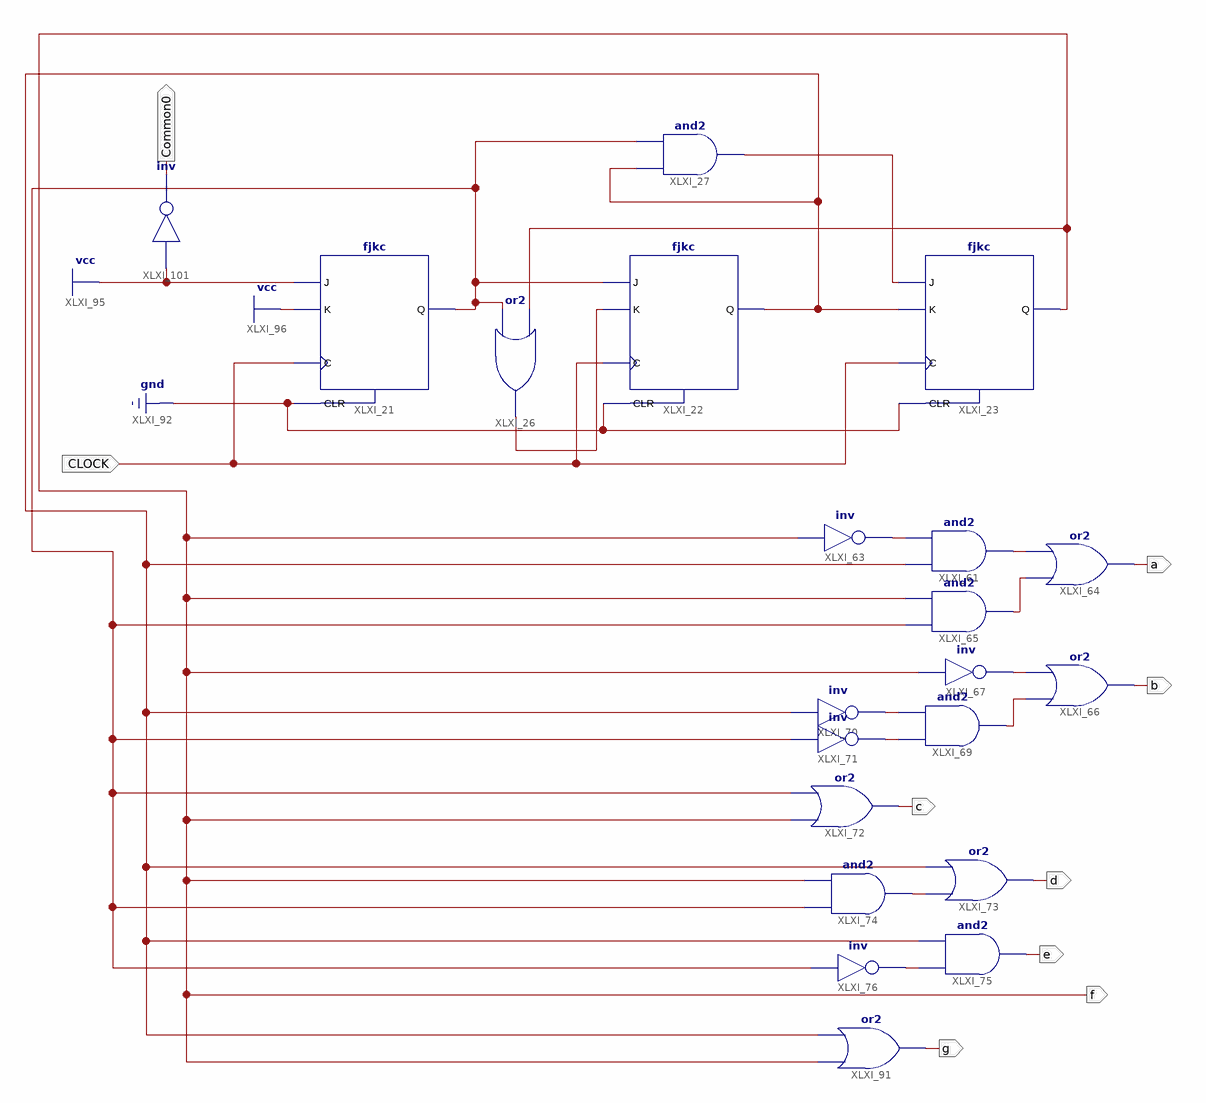
[diagram p0: schematic sheet 1]
// Xilinx ISE schematic CarBuzzer.sch (spartan6) as structural Verilog: 21 symbols, 9 ports
module CarBuzzer (
  input  CLOCK,
  output f,
  output b,
  output c,
  output d,
  output e,
  output g,
  output a,
  output Common0
);

  wire apin, XLXN_3, XLXN_10, XLXN_12, XLXN_81, XLXN_82, XLXN_86, XLXN_87, XLXN_89, XLXN_90, XLXN_91,
       XLXN_92, XLXN_93;

  fjkc XLXI_21 (.C(CLOCK), .CLR(1'b0), .J(1'b1), .K(1'b1), .Q(apin));
  fjkc XLXI_23 (.C(CLOCK), .CLR(1'b0), .J(XLXN_3), .K(XLXN_10), .Q(f));
  fjkc XLXI_22 (.C(CLOCK), .CLR(1'b0), .J(apin), .K(XLXN_12), .Q(XLXN_10));
  and XLXI_27 (XLXN_3, XLXN_10, apin);
  or XLXI_26 (XLXN_12, apin, f);
  and XLXI_61 (XLXN_82, XLXN_10, XLXN_81);
  not XLXI_63 (XLXN_81, f);
  or XLXI_64 (a, XLXN_86, XLXN_82);
  and XLXI_65 (XLXN_86, apin, f);
  or XLXI_66 (b, XLXN_89, XLXN_87);
  not XLXI_67 (XLXN_87, f);
  and XLXI_69 (XLXN_89, XLXN_91, XLXN_90);
  not XLXI_70 (XLXN_90, XLXN_10);
  not XLXI_71 (XLXN_91, apin);
  or XLXI_72 (c, f, apin);
  or XLXI_73 (d, XLXN_92, XLXN_10);
  and XLXI_74 (XLXN_92, apin, f);
  and XLXI_75 (e, XLXN_93, XLXN_10);
  not XLXI_76 (XLXN_93, apin);
  or XLXI_91 (g, f, XLXN_10);
  not XLXI_101 (Common0, 1'b1);
endmodule
